# EAGLE design DonglePi (EAGLE 7.2.0)
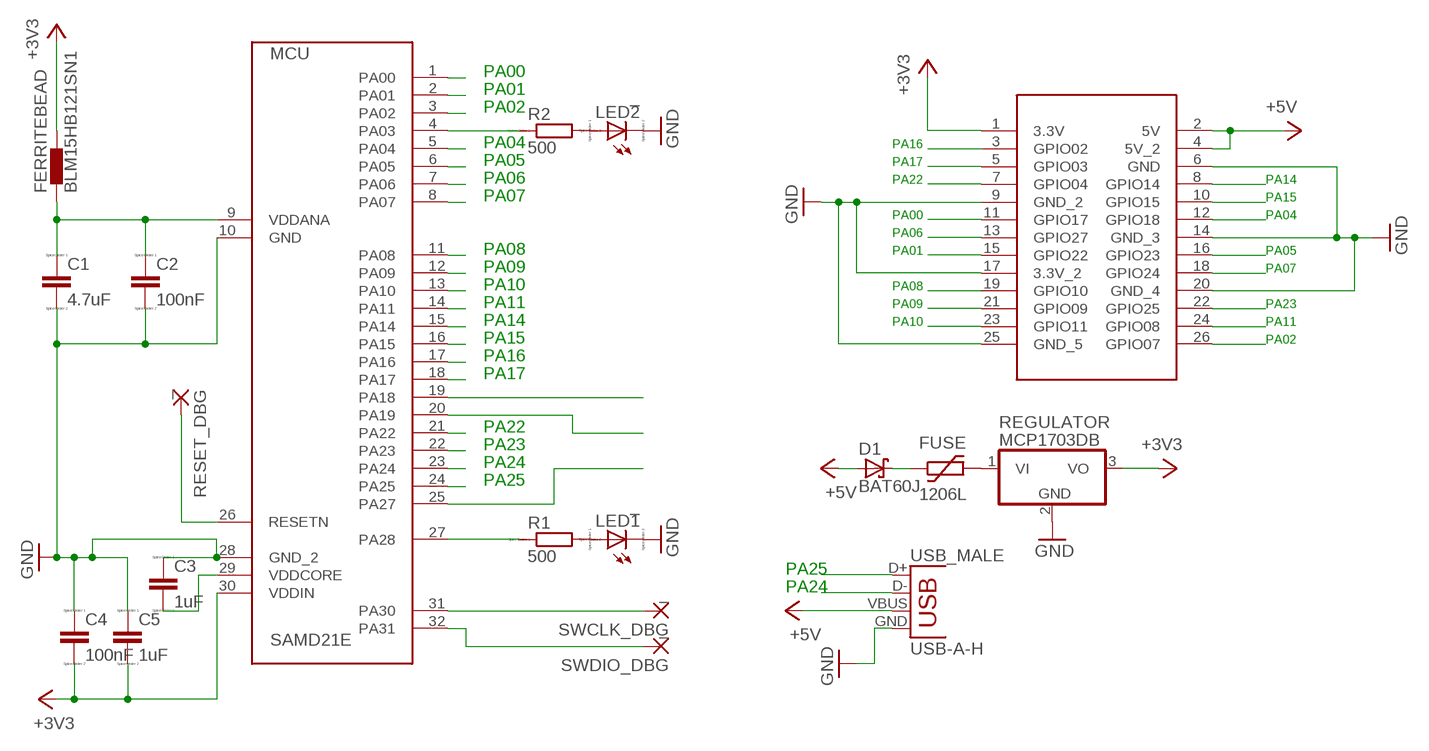
[diagram p0: schematic, sheet 1]

## Parts
C1  4.7uF  CC0504  [C0504]
C2  100nF  CC0504  [C0504]
C3  1uF  CC0504  [C0504]
C4  100nF  CC0504  [C0504]
C5  1uF  CC0504  [C0504]
D1  BAT60J  [SOD323_ST]
FERRITEBEAD  BLM15HB121SN1  [0402]
FUSE  1206L  [1206L]
LED1  _  LED_ESML0603  [LED_SML0603]
LED2  _  LED_ESML0603  [LED_SML0603]
MCU  SAMD21E  [TQFP32]
R1  500  RR0201  [R0201]
R2  500  RR0201  [R0201]
REGULATOR  MCP1703DB  [SOT223]
RESET_DBG  _  1,6/0,8  [1,6/0,8]
RPIO  RPI_2X13  [2X13]
SWCLK_DBG  _  1,6/0,8  [1,6/0,8]
SWDIO_DBG  _  1,6/0,8  [1,6/0,8]
USB_MALE  USB-A-H  [USB-A-H]

## Nets
+3V3 [3VPower]: C4.2 C5.2 FERRITEBEAD.2 MCU.30(VDDIN) REGULATOR.3(VO) RPIO.1(3.3V)
+5V [5V]: D1.A RPIO.2(5V) RPIO.4(5V_2) USB_MALE.VBUS
GND [Ground]: C1.2 C2.2 C3.1 C4.1 C5.1 LED1.C LED2.C MCU.10(GND) MCU.28(GND_2) REGULATOR.2(GND) RPIO.6(GND) RPIO.9(GND_2) RPIO.14(GND_3) RPIO.17(3.3V_2) RPIO.20(GND_4) RPIO.25(GND_5) USB_MALE.GND
N$1: FUSE.P$2 REGULATOR.1(VI)
N$2 [5V]: D1.C FUSE.P$1
N$3: MCU.27(PA28) R1.1
N$4: LED1.A R1.2
N$5: C1.1 C2.1 FERRITEBEAD.1 MCU.9(VDDANA)
N$6: LED2.A R2.2
N$7: MCU.26(RESETN) RESET_DBG.1(P)
N$8: C3.2 MCU.29(VDDCORE)
PA00: MCU.1(PA00) RPIO.11(GPIO17)
PA01: MCU.2(PA01) RPIO.15(GPIO22)
PA02: MCU.3(PA02) RPIO.26(GPIO07)
PA03: MCU.4(PA03) R2.1
PA04: MCU.5(PA04) RPIO.12(GPIO18)
PA05: MCU.6(PA05) RPIO.16(GPIO23)
PA06: MCU.7(PA06) RPIO.13(GPIO27)
PA07: MCU.8(PA07) RPIO.18(GPIO24)
PA08: MCU.11(PA08) RPIO.19(GPIO10)
PA09: MCU.12(PA09) RPIO.21(GPIO09)
PA10: MCU.13(PA10) RPIO.23(GPIO11)
PA11: MCU.14(PA11) RPIO.24(GPIO08)
PA14: MCU.15(PA14) RPIO.8(GPIO14)
PA15: MCU.16(PA15) RPIO.10(GPIO15)
PA16: MCU.17(PA16) RPIO.3(GPIO02)
PA17: MCU.18(PA17) RPIO.5(GPIO03)
PA18: MCU.19(PA18)
PA19: MCU.20(PA19)
PA22: MCU.21(PA22) RPIO.7(GPIO04)
PA23: MCU.22(PA23) RPIO.22(GPIO25)
PA24: MCU.23(PA24) USB_MALE.D-
PA25: MCU.24(PA25) USB_MALE.D+
PA27: MCU.25(PA27)
PA30: MCU.31(PA30) SWCLK_DBG.1(P)
PA31: MCU.32(PA31) SWDIO_DBG.1(P)

## Library data of the parts
C1-C5 = eagle-ltspice:C: CAPACITOR, European symbol; SPICEMODEL: NONE; SPICEPREFIX: C
D1 = diode:BAT60J: Schottky barrier diode Source: www.st.com, BAT60J.pdf
FERRITEBEAD = inductors:BLM15H: EMIFIL (R) Chip Ferrite Bead for GHz Noise Source: http://www.murata.com/ Ferrite Bead BLM15H.pdf
FUSE = gbin:1206L
LED1 LED2 = eagle-ltspice:LED_E: LED Source: http://www.osram.convergy.de Source: www.luxeon.com Source: www.kingbright.com; SPICEMODEL: NONE; SPICEPREFIX: D; SPICETYPE: diode
MCU = gbin:SAMD21E: SIMD21E
R1 R2 = eagle-ltspice:R: RESISTOR, European symbol; SPICEMODEL: NONE; SPICEPREFIX: R
REGULATOR = linear:MCP1703: 250 mA, 16V, Low Quiescent Current LDO Regulator Source: http://ww1.microchip.com/downloads/en/DeviceDoc/22049b.pdf
RESET_DBG SWCLK_DBG SWDIO_DBG = wirepad:1,6/0,8: THROUGH-HOLE PAD
RPIO = gbin:RPI_2X13
USB_MALE = gbin:USB: USB Connectors USB-B-PTH is fully proven SKU : PRT-00139/CONN-08278 USB-miniB is fully proven SKU : PRT-00587 USB-A-PCB is untested. USB-A-H is throughly reviewed, but untested. Spark Fun Electronics SKU : PRT-00437 USB-B-SMT is throughly reviewed, but untested. Needs silkscreen touching up. USB-A-S has not been used/tested USB-MB-H has not been used/tested USB-MICROB has been used. CONN-09505

## Net classes
0 default: width 0.254 mm
1 3VPower: width 0.305 mm
2 5V: width 0.305 mm
3 Ground: width 0.305 mm

## Board
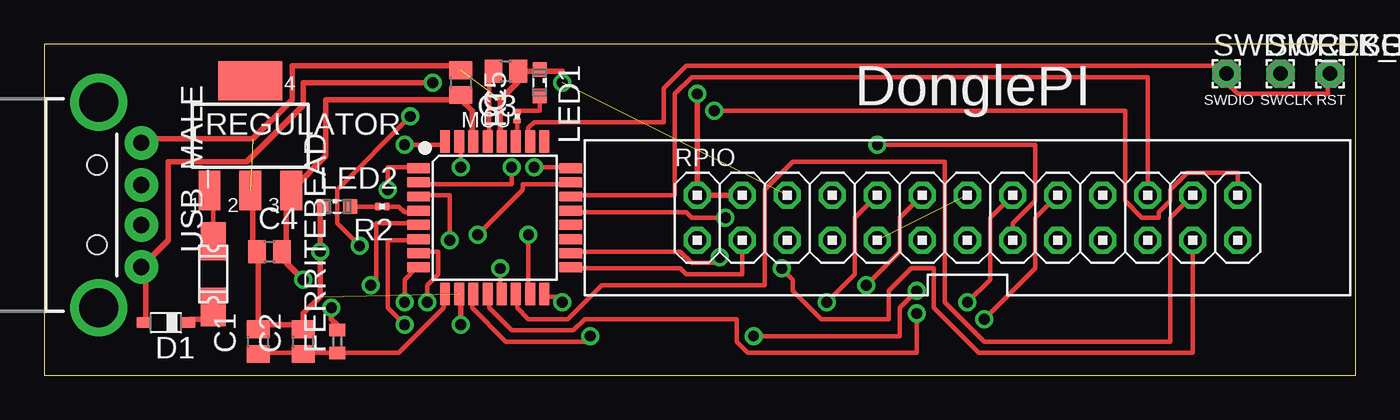
[diagram p1: board, top side]
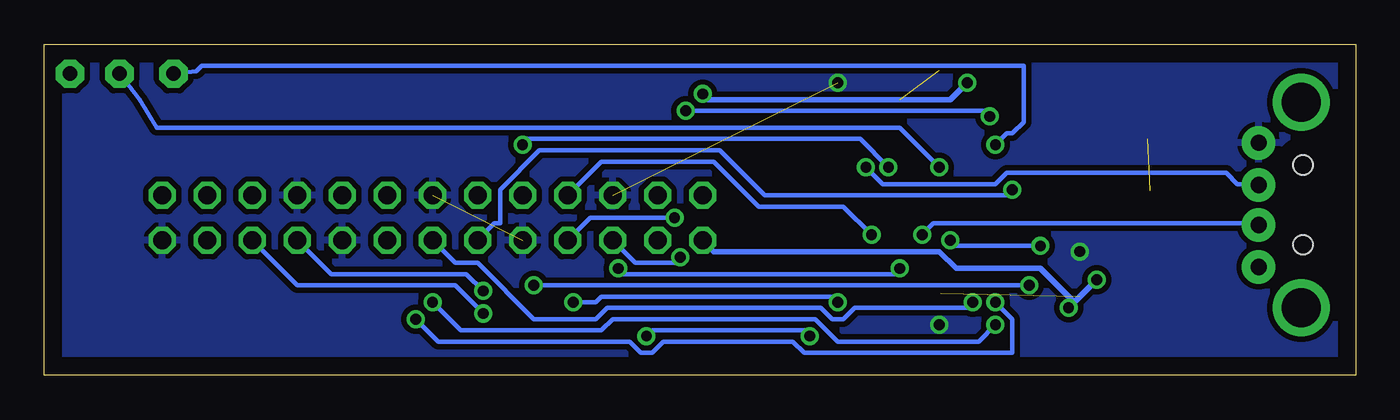
[diagram p2: board, bottom side, seen from below]

Size 73.97 x 18.68 mm. Coordinates in mm from the lower left corner, seen from the top.
Outline: 0,0 73.97,0 73.97,18.68 0,18.68 0,0
Copper layers (1*16): Top 0.035mm / dielectric 1.5mm / Bottom 0.035mm
Design rules "default": minimum track width 10mil, minimum drill 24mil, track to track 8mil, track to pad 8mil, pad to pad 8mil, via to via 8mil, smd to smd 8mil, copper to edge 40mil, drill to drill 8mil, minimum pad ring 10mil, minimum via ring 8mil, stop-mask expansion 4mil, vias tented up to drill 0mil, thermal gap 10mil

### Footprints (pad centres in the part's own frame; a part is rotated, then mirrored left to right if it is on the bottom)
C0504 = smd 1 x 1.3: 1 -0.7,0; 2 0.7,0
SOD323_ST = smd 0.8 x 0.6: A 1.25,0; C -1.25,0
0402 = smd 0.7 x 0.9: 1 -0.65,0; 2 0.65,0
1206L = smd 2.16 x 1.4: P$1 -1.85,0; P$2 1.85,0
LED_SML0603 = smd 0.8 x 0.8: A 0.75,0; C -0.75,0
TQFP32 = smd 1.27 x 0.559: 1 -4.293,2.8; 2 -4.293,2; 3 -4.293,1.2; 4 -4.293,0.4; 5 -4.293,-0.4; 6 -4.293,-1.2; 7 -4.293,-2; 8 -4.293,-2.8; 17 4.293,-2.8; 18 4.293,-2; 19 4.293,-1.2; 20 4.293,-0.4; 21 4.293,0.4; 22 4.293,1.2; 23 4.293,2; 24 4.293,2.8 | smd 0.559 x 1.27: 9 -2.8,-4.293; 10 -2,-4.293; 11 -1.2,-4.293; 12 -0.4,-4.293; 13 0.4,-4.293; 14 1.2,-4.293; 15 2,-4.293; 16 2.8,-4.293; 25 2.8,4.293; 26 2,4.293; 27 1.2,4.293; 28 0.4,4.293; 29 -0.4,4.293; 30 -1.2,4.293; 31 -2,4.293; 32 -2.8,4.293
R0201 = smd 0.28 x 0.43: 1 -0.255,0; 2 0.255,0
SOT223 = smd 1.219 x 2.235: 1 -2.311,-3.099; 2 0,-3.099; 3 2.311,-3.099 | smd 3.6 x 2.2: 4 0,3.099
1,6/0,8 = drill 0.813 pad 1.6 octagon: 1 0,0
2X13 = drill 1.016 octagon: 1 -15.24,-1.27; 2 -15.24,1.27; 3 -12.7,-1.27; 4 -12.7,1.27; 5 -10.16,-1.27; 6 -10.16,1.27; 7 -7.62,-1.27; 8 -7.62,1.27; 9 -5.08,-1.27; 10 -5.08,1.27; 11 -2.54,-1.27; 12 -2.54,1.27; 13 0,-1.27; 14 0,1.27; 15 2.54,-1.27; 16 2.54,1.27; 17 5.08,-1.27; 18 5.08,1.27; 19 7.62,-1.27; 20 7.62,1.27; 21 10.16,-1.27; 22 10.16,1.27; 23 12.7,-1.27; 24 12.7,1.27; 25 15.24,-1.27; 26 15.24,1.27
USB-A-H = drill 0.914 pad 1.88: D+ 2.4,1.127; D- 2.4,-1.127; GND 2.4,3.5; VBUS 2.4,-3.5 | drill 2.2: GND2 0,-5.8; GND3 0,5.8 | hole 1.1: -0.1,2.25; -0.1,-2.25

### Placement (x,y rotation side)
C1  12.06,1.91 90 top
C2  14.61,1.91 90 top
C3  26.04,17.15 180 top
C4  12.7,6.98 0 top
C5  23.5,16.51 270 top
D1  6.86,2.98 180 top
FERRITEBEAD  16.51,1.91 90 top
FUSE  9.53,5.71 90 top
LED1  27.94,16.51 270 top
LED2  16.51,9.53 0 top
MCU  25.4,8.89 0 top
R1  26.67,14.61 90 top
R2  19.05,9.53 180 top
REGULATOR  11.62,13.52 0 top
RESET_DBG  72.52,17.02 0 top
RPIO  52.07,8.89 0 top
SWCLK_DBG  69.72,17.02 0 top
SWDIO_DBG  66.67,17.02 0 top
USB_MALE  3.07,9.62 0 top

### Tracks (layer width: path | path; a pad name or v marks a point on that pad's centre or on a via)
+3V3  (via drill 0.61)
  Top 0.305: 23.5,15.56 24.13,14.92 24.13,13.33 MCU.30 | v16.19,3.81 16.19,3.17 16.51,2.86 FERRITEBEAD.2 | v14.61,5.4 13.65,6.35 13.65,6.98 | 13.65,6.98 13.65,10.16 REGULATOR.3 13.97,10.48 15.88,12.38 15.88,15.56 23.5,15.56 | 13.65,6.98 C4.2 | 23.5,15.56 C5.2
  Bottom 0.305: v14.61,5.4 15.88,4.13 | RPIO.1 36.2,6.98 23.5,6.98 22.54,6.03 17.78,6.03 15.88,4.13 | 15.88,4.13 v16.19,3.81
+5V  (via drill 0.61)
  Top 0.305: RPIO.4 RPIO.2 v36.83,15.88 | D1.A 5.71,3.17 5.71,6.03 USB_MALE.VBUS 5.71,6.35 6.99,7.62 6.99,12.06 11.43,12.06 14.61,15.24 14.61,16.51 v21.91,16.51
  Bottom 0.305: v36.83,15.88 36.51,15.56 22.86,15.56 v21.91,16.51
GND  (via drill 0.61)  (5 unrouted)
  Top 0.305: REGULATOR.2 11.75,10.16 11.75,6.98 C4.1 12.06,6.98 12.06,2.86 | 14.61,2.86 14.61,3.49 15.56,4.45 v15.56,6.98 15.56,9.53 LED2.C | 14.61,2.86 12.06,2.86 | 14.61,2.86 C2.2 | 12.06,2.86 C1.2 | 27.94,17.15 C3.1 26.67,17.15 26.67,16.51 25.72,15.56 25.72,13.33 MCU.28 | v23.5,2.86 23.5,4.45 MCU.10 | C5.1 23.5,17.46 13.97,17.46 13.97,15.56 11.75,13.33 5.71,13.33 USB_MALE.GND | 27.94,17.15 29.21,17.15 v29.21,16.51 | 27.94,17.15 LED1.C
  pour Bottom (isolate 0.305): 0,19.05 0,0 73.66,0 73.66,19.05
N$1
  Top 0.254: FUSE.P$2 9.53,10.16 REGULATOR.1
N$2
  Top 0.305: FUSE.P$1 9.53,3.17 8.26,3.17 D1.C
N$3
  Top 0.254: R1.1 26.67,13.33 MCU.27
N$4
  Top 0.254: LED1.A 27.94,14.92 26.67,14.92 R1.2
N$5
  Top 0.254: 14.61,1.27 16.51,1.27 | 16.51,1.27 20,1.27 22.54,3.81 22.54,4.45 MCU.9 | 16.51,1.27 FERRITEBEAD.1 | 14.61,1.27 12.06,1.27 C1.1 | 14.61,1.27 C2.1
N$6
  Top 0.254: LED2.A R2.2
N$7
  Top 0.254: MCU.26 27.3,13.33 27.3,13.97 27.62,14.29 34.92,14.29 34.92,16.19 36.2,17.46 66.67,17.46 66.67,16.51 67.31,15.88 72.39,15.88 72.39,16.83 RESET_DBG.1
N$8
  Top 0.254: MCU.29 25.08,13.33 25.08,17.15 C3.2
PA00  (via drill 0.61)
  Top 0.254: v19.37,10.48 19.37,11.75 20.95,11.75 MCU.1
  Bottom 0.254: v19.37,10.48 19.68,10.16 33.34,10.16 35.88,12.7 46.04,12.7 48.26,10.48 48.26,8.57 48.58,8.57 RPIO.11
PA01  (via drill 0.61)
  Top 0.254: v26.35,11.75 26.35,10.79 21.27,10.79 MCU.2 | v46.99,13.02 55.88,13.02 55.88,9.84 54.61,8.57 RPIO.15
  Bottom 0.254: v26.35,11.75 27.94,13.33 46.67,13.33 v46.99,13.02
PA02  (via drill 0.61)
  Top 0.254: v22.86,7.62 22.86,10.16 21.27,10.16 MCU.3 | v17.78,7.3 16.51,8.57 16.51,10.48 v20.64,14.61 | v37.78,14.92 60.96,14.92 60.96,9.84 61.91,8.89 62.87,8.89 62.87,9.21 63.5,9.84 63.5,10.48 64.45,11.43 67.31,11.43 RPIO.26
  Bottom 0.254: v22.86,7.62 22.54,7.3 v17.78,7.3 | v20.64,14.61 20.95,14.92 v37.78,14.92
PA03
  Top 0.254: R2.1 20,9.53 20.32,9.21 20.95,9.21 MCU.4
PA04  (via drill 0.61)
  Top 0.254: v18.41,5.08 18.73,5.4 18.73,8.57 20.95,8.57 MCU.5 | v46.35,5.08 48.26,6.98 48.26,8.89 RPIO.12
  Bottom 0.254: v46.35,5.08 v18.41,5.08
PA05  (via drill 0.61)
  Top 0.254: v20.32,2.86 19.37,3.81 19.37,7.62 20.95,7.62 MCU.6 | v52.07,4.13 53.34,5.4 53.34,8.89 RPIO.16
  Bottom 0.254: v20.32,2.86 21.27,1.91 29.21,1.91 30.48,3.17 41.91,3.17 42.55,2.54 50.48,2.54 v52.07,4.13
PA06  (via drill 0.61)
  Top 0.254: v21.59,4.13 21.59,5.08 22.23,5.71 22.23,6.98 21.27,6.98 MCU.7
  Bottom 0.254: v21.59,4.13 21.91,3.81 28.26,3.81 28.89,3.17 29.53,3.17 30.16,3.81 42.23,3.81 42.86,3.17 46.35,3.17 49.53,6.35 50.8,6.35 RPIO.13
PA07  (via drill 0.61)
  Top 0.254: v20.32,4.13 20.32,5.4 20.95,6.03 MCU.8 | v53.02,3.17 55.88,6.03 55.88,8.89 RPIO.18
  Bottom 0.254: v20.32,4.13 19.37,3.17 19.37,1.27 31.11,1.27 31.75,1.91 39.05,1.91 39.69,1.27 40.32,1.27 40.96,1.91 51.75,1.91 v53.02,3.17
PA08  (via drill 0.61)
  Top 0.254: v30.8,2.22 30.8,1.91 26.04,1.91 24.13,3.81 24.13,4.45 MCU.11 | v40.01,2.22 48.26,2.22 48.26,3.81 v49.21,4.76
  Bottom 0.254: v30.8,2.22 31.11,2.54 39.69,2.54 v40.01,2.22 | v49.21,4.76 50.16,5.71 57.78,5.71 RPIO.19
PA09  (via drill 0.61)
  Top 0.254: v49.21,3.49 49.21,1.27 39.69,1.27 39.05,1.91 39.05,3.17 30.48,3.17 29.84,2.54 26.35,2.54 25.08,3.81 25.08,4.45 MCU.12
  Bottom 0.254: v49.21,3.49 50.8,5.08 59.69,5.08 RPIO.21
PA10  (via drill 0.61)
  Top 0.254: v25.72,6.03 25.72,4.76 MCU.13 | v41.59,6.03 42.23,5.4 42.23,4.76 43.81,3.17 47.62,3.17 47.62,4.76 48.9,6.03 50.16,6.03 50.16,3.81 52.7,1.27 64.77,1.27 RPIO.23
  Bottom 0.254: v25.72,6.03 26.04,5.71 41.27,5.71 v41.59,6.03
PA11
  Top 0.254: RPIO.24 63.5,8.89 63.5,1.91 53.02,1.91 50.8,4.13 50.8,12.06 42.23,12.06 40.64,10.48 40.64,5.08 31.43,5.08 29.53,3.17 27.3,3.17 26.67,3.81 26.67,4.45 MCU.14
PA14  (via drill 0.61)
  Top 0.254: v27.3,7.94 27.3,4.76 MCU.15
  Bottom 0.254: v27.3,7.94 28.89,9.53 33.66,9.53 36.2,12.06 42.55,12.06 RPIO.8
PA15  (via drill 0.61)
  Top 0.254: v29.21,4.13 29.21,4.45 28.26,4.45 MCU.16 | v44.13,4.13 45.72,5.71 45.72,8.89 RPIO.10
  Bottom 0.254: v29.21,4.13 29.53,4.45 42.55,4.45 42.86,4.13 v44.13,4.13
PA16
  Top 0.254: RPIO.3 39.37,5.71 36.2,5.71 35.88,6.03 29.84,6.03 MCU.17
PA17  (via drill 0.61)
  Top 0.254: v38.1,6.67 38.1,6.35 36.51,6.35 35.88,6.98 29.84,6.98 MCU.18
  Bottom 0.254: v38.1,6.67 38.42,6.35 40.64,6.35 RPIO.5
PA22  (via drill 0.61)
  Top 0.254: v38.42,8.89 36.51,8.89 36.2,9.21 29.84,9.21 MCU.21
  Bottom 0.254: v38.42,8.89 43.18,8.89 RPIO.7
PA23
  Top 0.254: RPIO.22 62.23,16.83 36.51,16.83 35.56,15.88 35.56,10.16 29.84,10.16 MCU.22
PA24  (via drill 0.61)
  Top 0.254: v24.45,7.94 26.99,10.48 26.99,10.79 29.53,10.79 MCU.23
  Bottom 0.254: v24.45,7.94 23.81,8.57 5.71,8.57 USB_MALE.D-
PA25  (via drill 0.61)
  Top 0.254: v27.62,11.75 29.53,11.75 MCU.24
  Bottom 0.254: v27.62,11.75 26.67,10.79 20.32,10.79 19.68,11.43 7.3,11.43 6.67,10.79 5.71,10.79 USB_MALE.D+
PA30  (via drill 0.61)
  Top 0.254: v23.5,11.75 23.5,13.02 MCU.31
  Bottom 0.254: v23.5,11.75 25.72,13.97 67.63,13.97 68.58,15.56 SWCLK_DBG.1
PA31  (via drill 0.61)
  Top 0.254: v20.32,13.02 22.54,13.02 MCU.32
  Bottom 0.254: v20.32,13.02 19.68,13.65 19.37,13.65 18.73,14.29 18.73,17.46 65.09,17.46 65.41,17.15 SWDIO_DBG.1

### Text on the board
tPlace: DonglePI | SWDIO | SWCLK | RST